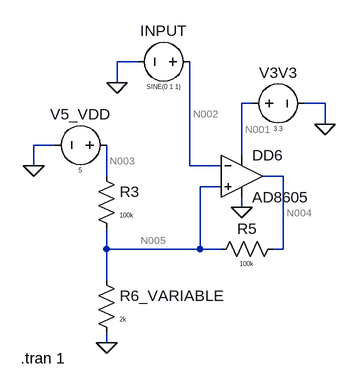
[diagram p0: schematic trigger.asc]
trigger.asc, the LTspice schematic file:
Version 4
SHEET 1 880 680
WIRE 16 0 -16 0
WIRE -16 32 -16 0
WIRE 192 64 176 64
WIRE 304 64 272 64
WIRE 304 96 304 64
WIRE -112 128 -144 128
WIRE 176 144 176 64
WIRE -144 160 -144 128
WIRE 96 160 96 0
WIRE 144 160 96 160
WIRE -32 176 -32 128
WIRE 240 176 208 176
WIRE 144 192 112 192
WIRE 176 224 176 208
WIRE -32 288 -32 256
WIRE 112 288 112 192
WIRE 112 288 -32 288
WIRE 144 288 112 288
WIRE 240 288 240 176
WIRE 240 288 224 288
WIRE -32 336 -32 288
WIRE -32 432 -32 416
FLAG -32 432 0
FLAG 176 224 0
FLAG -144 160 0
FLAG 304 96 0
FLAG -16 32 0
SYMBOL OpAmps\\AD8605 176 112 R0
SYMATTR InstName DD6
SYMBOL res 240 272 R90
WINDOW 0 0 56 VBottom 2
WINDOW 3 32 56 VTop 0
SYMATTR InstName R5
SYMATTR Value 100k
SYMBOL res -48 160 R0
WINDOW 3 36 76 Left 0
SYMATTR InstName R3
SYMATTR Value 100k
SYMBOL res -48 320 R0
WINDOW 3 36 76 Left 0
SYMATTR InstName R6_VARIABLE
SYMATTR Value 2k
SYMBOL voltage 176 64 R270
WINDOW 0 32 56 VTop 2
WINDOW 3 -32 56 VBottom 0
WINDOW 123 0 0 Left 0
WINDOW 39 0 0 Left 0
SYMATTR InstName V3V3
SYMATTR Value 3.3
SYMBOL voltage -16 128 R90
WINDOW 0 -32 56 VBottom 2
WINDOW 3 32 56 VTop 0
WINDOW 123 0 0 Left 0
WINDOW 39 0 0 Left 0
SYMATTR InstName V5_VDD
SYMATTR Value 5
SYMBOL voltage 112 0 R90
WINDOW 0 -32 56 VBottom 2
WINDOW 3 32 56 VTop 0
WINDOW 123 0 0 Left 0
WINDOW 39 0 0 Left 0
SYMATTR InstName INPUT
SYMATTR Value SINE(0 1 1)
TEXT -164 456 Left 2 !.tran 1

The netlist it stands for:
* trigger.asc
XDD6 N005 N002 N001 0 N004 AD8605  ; pins In+ In- V+ V- OUT
R5 N004 N005 100k
R3 N003 N005 100k
R6_VARIABLE N005 0 2k
V3V3 N001 0 3.3
V5_VDD N003 0 5
V§INPUT N002 0 SINE(0 1 1)
.tran 1
.lib ADI.lib
.backanno
.end

* Results of the author's LTspice run, read from the files saved beside the schematic
* Operating Point, zero values left out:
*   V(n001) = 3.3 V
*   V(n005) = 159.6 mV
*   V(n004) = 3.298 V
*   V(n003) = 5 V
*   I(R6_variable) = 79.79 µA
*   I(R3) = 48.4 µA
*   I(R5) = 31.39 µA
*   I(V5_vdd) = -48.4 µA
*   I(V3v3) = -362.4 µA
*   Ix(dd6:99) = 362.4 µA
*   Ix(dd6:50) = -331 µA
*   Ix(dd6:45) = -31.39 µA
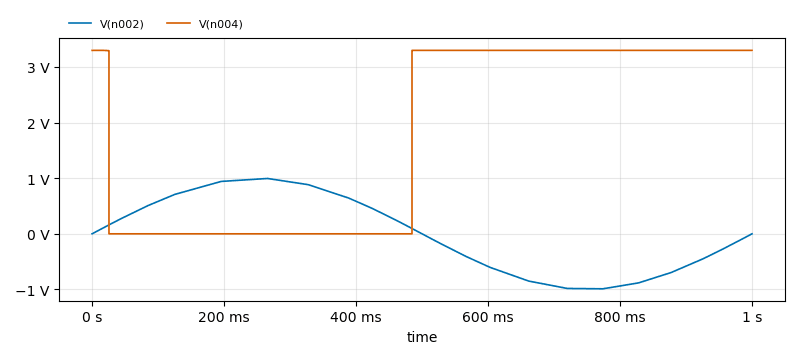
[diagram p1: Transient Analysis of trigger.asc, plotted from the saved traces]
* Transient Analysis, 1 run:
*   V(n002): min -988.6 mV, max 995 mV, average -993.3 µV, rms 702.8 mV, last 0 V
*   V(n004): min 34.38 µV, max 3.298 V, average 1.784 V, rms 2.426 V, last 3.298 V